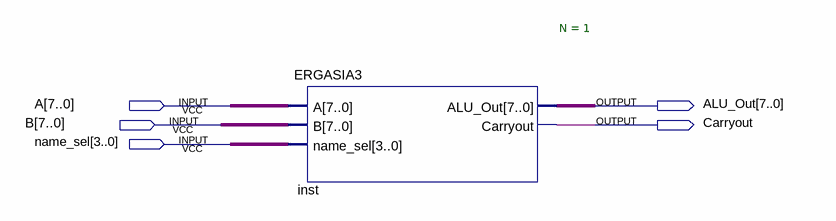
[diagram p0: schematic sheet]
// Quartus schematic Block1.bdf as structural Verilog: 1 symbols, 5 pins
module Block1 (
  input  [7:0] A,
  input  [7:0] B,
  input  [3:0] name_sel,
  output [7:0] ALU_Out,
  output Carryout
);

  ERGASIA3 #(.N(1)) inst (.A(A), .B(B), .name_sel(name_sel), .ALU_Out(ALU_Out), .Carryout(Carryout));
endmodule
